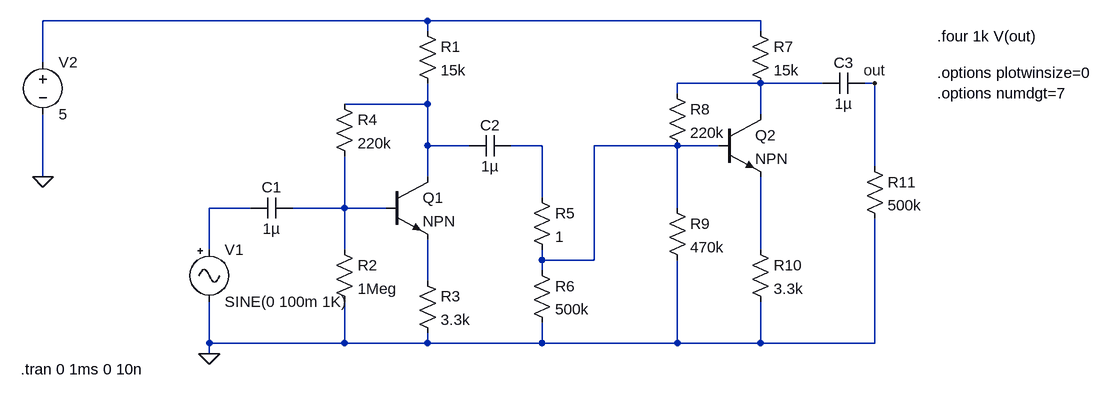
[diagram p0: schematic Draft1.asc]
Draft1.asc, the LTspice schematic file:
Version 4
SHEET 1 1368 680
WIRE 288 -208 -304 -208
WIRE 800 -208 288 -208
WIRE 288 -192 288 -208
WIRE 800 -192 800 -208
WIRE -304 -144 -304 -208
WIRE 800 -112 672 -112
WIRE 896 -112 800 -112
WIRE 976 -112 960 -112
WIRE 672 -96 672 -112
WIRE 288 -80 288 -112
WIRE 288 -80 160 -80
WIRE 800 -64 800 -112
WIRE 288 -16 288 -80
WIRE 352 -16 288 -16
WIRE 464 -16 416 -16
WIRE 672 -16 544 -16
WIRE 736 -16 672 -16
WIRE 976 16 976 -112
WIRE -304 32 -304 -64
WIRE 288 32 288 -16
WIRE 464 64 464 -16
WIRE 16 80 -48 80
WIRE 160 80 160 0
WIRE 160 80 80 80
WIRE 224 80 160 80
WIRE 672 80 672 -16
WIRE -48 144 -48 80
WIRE 160 144 160 80
WIRE 800 144 800 32
WIRE 464 160 464 144
WIRE 544 160 544 -16
WIRE 544 160 464 160
WIRE 464 176 464 160
WIRE 288 192 288 128
WIRE -48 288 -48 224
WIRE 160 288 160 224
WIRE 160 288 -48 288
WIRE 288 288 288 272
WIRE 288 288 160 288
WIRE 464 288 464 256
WIRE 464 288 288 288
WIRE 672 288 672 160
WIRE 672 288 464 288
WIRE 800 288 800 224
WIRE 800 288 672 288
WIRE 976 288 976 96
WIRE 976 288 800 288
WIRE -48 304 -48 288
FLAG -304 32 0
FLAG -48 304 0
FLAG 976 -112 out
SYMBOL Misc\\signal -48 128 R0
SYMATTR InstName V1
SYMATTR Value SINE(0 100m 1K)
SYMBOL npn 224 32 R0
SYMATTR InstName Q1
SYMBOL voltage -304 -160 R0
SYMATTR InstName V2
SYMATTR Value 5
SYMBOL res 272 -208 R0
SYMATTR InstName R1
SYMATTR Value 15k
SYMBOL cap 80 64 R90
WINDOW 0 0 32 VBottom 2
WINDOW 3 32 32 VTop 2
SYMATTR InstName C1
SYMATTR Value 1µ
SYMBOL res 144 128 R0
SYMATTR InstName R2
SYMATTR Value 1Meg
SYMBOL res 272 176 R0
SYMATTR InstName R3
SYMATTR Value 3.3k
SYMBOL res 144 -96 R0
SYMATTR InstName R4
SYMATTR Value 220k
SYMBOL cap 416 -32 R90
WINDOW 0 0 32 VBottom 2
WINDOW 3 32 32 VTop 2
SYMATTR InstName C2
SYMATTR Value 1µ
SYMBOL res 448 48 R0
SYMATTR InstName R5
SYMATTR Value 1
SYMBOL res 448 160 R0
SYMATTR InstName R6
SYMATTR Value 500k
SYMBOL npn 736 -64 R0
SYMATTR InstName Q2
SYMBOL res 784 -208 R0
SYMATTR InstName R7
SYMATTR Value 15k
SYMBOL res 656 -112 R0
SYMATTR InstName R8
SYMATTR Value 220k
SYMBOL res 656 64 R0
SYMATTR InstName R9
SYMATTR Value 470k
SYMBOL res 784 128 R0
SYMATTR InstName R10
SYMATTR Value 3.3k
SYMBOL cap 960 -128 R90
WINDOW 0 0 32 VBottom 2
WINDOW 3 32 32 VTop 2
SYMATTR InstName C3
SYMATTR Value 1µ
SYMBOL res 960 0 R0
SYMATTR InstName R11
SYMATTR Value 500k
TEXT -338 328 Left 2 !.tran 0 1ms 0 10n
TEXT 1072 -184 Left 2 !.four 1k V(out)
TEXT 1072 -128 Left 2 !.options plotwinsize=0\n.options numdgt=7

The netlist it stands for:
* Draft1.asc
V1 N006 0 SINE(0 100m 1K)
Q1 N003 N007 N009 0 NPN
V2 N001 0 5
R1 N001 N003 15k
C1 N007 N006 1µ
R2 N007 0 1Meg
R3 N009 0 3.3k
R4 N003 N007 220k
C2 N004 N003 1µ
R5 N004 N005 1
R6 N005 0 500k
Q2 N002 N005 N008 0 NPN
R7 N001 N002 15k
R8 N002 N005 220k
R9 N005 0 470k
R10 N008 0 3.3k
C3 out N002 1µ
R11 out 0 500k
.model NPN NPN
.model PNP PNP
.lib standard.bjt
.tran 0 1ms 0 10n
.four 1k V(out)
.options plotwinsize=0
.options numdgt=7
.backanno
.end